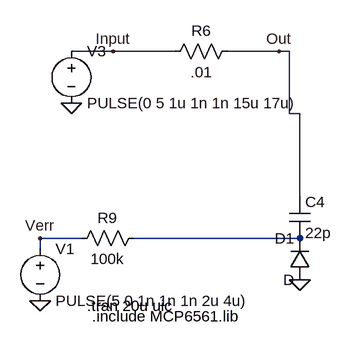
[diagram p0: schematic delay_reset.asc]
delay_reset.asc, the LTspice schematic file:
Version 4.1
SHEET 1 1076 680
WIRE -592 -96 -656 -96
WIRE -496 -96 -592 -96
WIRE -336 -96 -416 -96
WIRE -320 -96 -336 -96
WIRE -320 0 -320 -96
WIRE -304 0 -320 0
WIRE -304 128 -304 0
WIRE -640 192 -704 192
WIRE -304 192 -560 192
WIRE -704 208 -704 192
FLAG -592 -96 Input
FLAG -656 -16 0
FLAG -704 192 Verr
FLAG -336 -96 Out
FLAG -704 288 0
FLAG -304 256 0
SYMBOL voltage -656 -112 R0
WINDOW 123 0 0 Left 0
WINDOW 39 0 0 Left 0
SYMATTR InstName V3
SYMATTR Value PULSE(0 5 1u 1n 1n 15u 17u)
SYMBOL res -400 -112 R90
WINDOW 0 0 56 VBottom 2
WINDOW 3 32 56 VTop 2
SYMATTR InstName R6
SYMATTR Value .01
SYMBOL res -544 176 R90
WINDOW 0 0 56 VBottom 2
WINDOW 3 32 56 VTop 2
SYMATTR InstName R9
SYMATTR Value 100k
SYMBOL cap -320 128 R0
SYMATTR InstName C4
SYMATTR Value 22p
SYMBOL voltage -704 192 R0
WINDOW 123 0 0 Left 0
WINDOW 39 0 0 Left 0
SYMATTR InstName V1
SYMATTR Value PULSE(5 0 1n 1n 1n 2u 4u)
SYMBOL diode -288 256 R180
WINDOW 0 24 64 Left 2
WINDOW 3 24 0 Left 2
SYMATTR InstName D1
TEXT -624 312 Left 2 !.include MCP6561.lib
TEXT -632 296 Left 2 !.tran 20u uic

The netlist it stands for:
* delay_reset.asc
V3 Input 0 PULSE(0 5 1u 1n 1n 15u 17u)
R6 Out Input .01
R9 N001 Verr 100k
C4 Out N001 22p
V1 Verr 0 PULSE(5 0 1n 1n 1n 2u 4u)
D1 0 N001 D
.model D D
.lib standard.dio
.include MCP6561.lib
.tran 20u uic
.backanno
.end